# Altium project SoBrain.PrjPCB
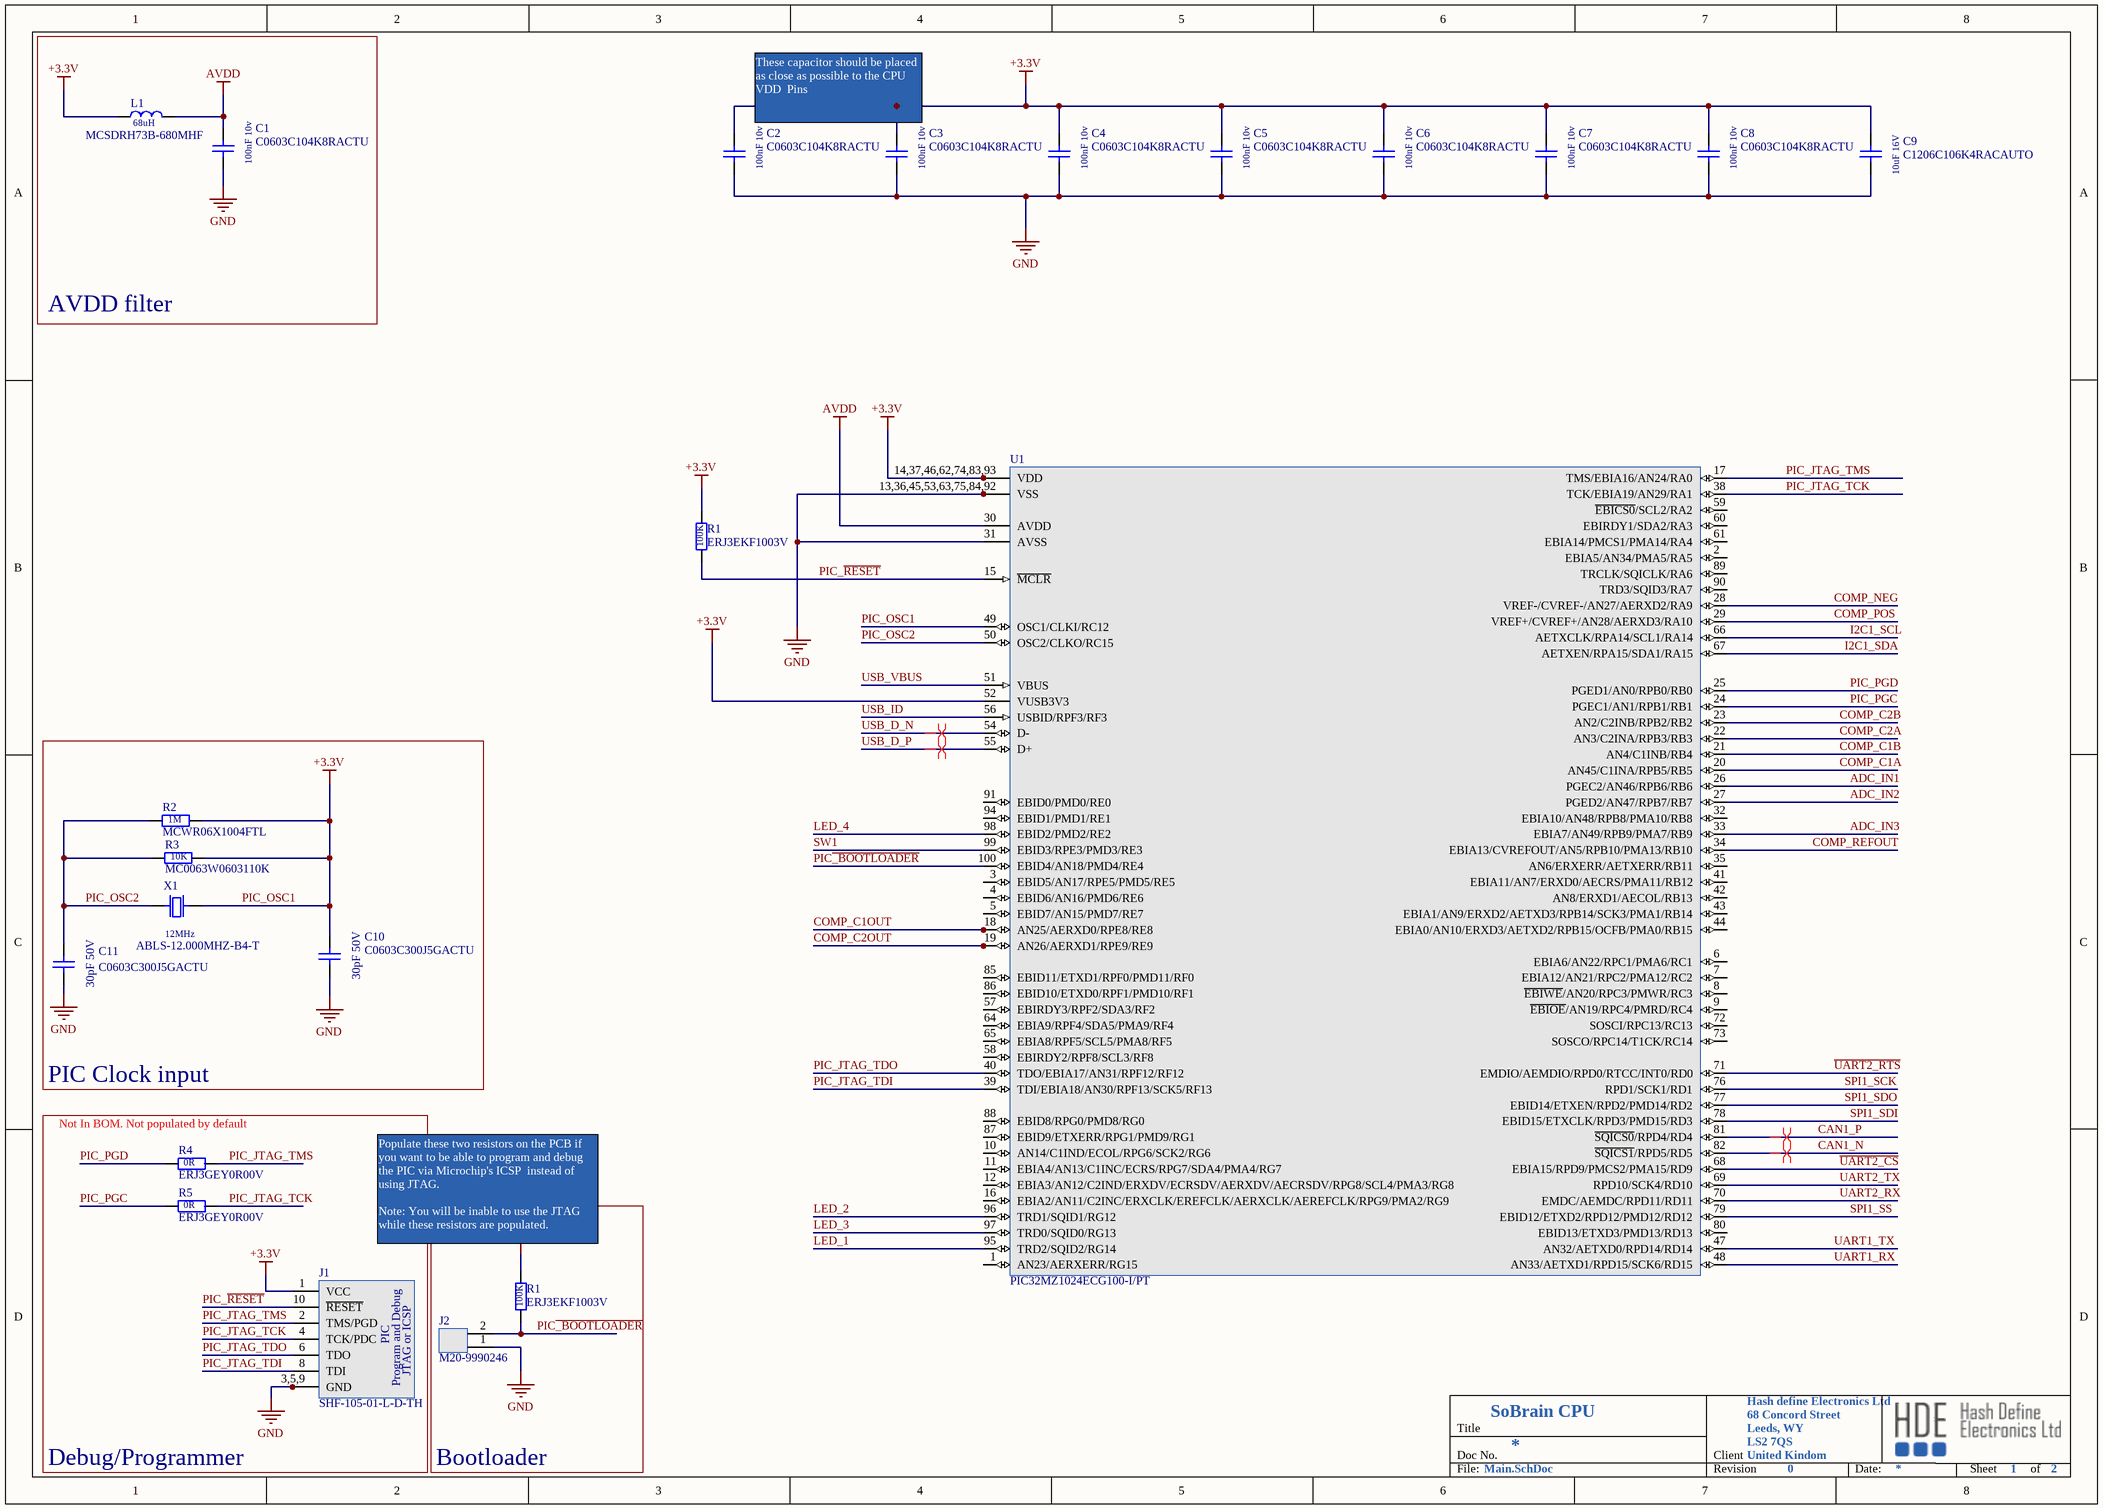
[diagram p0: Main.SchDoc]
2 sheets, 42 parts. Net scope: global (net labels, ports and power ports of the same name join across sheets).
Board file: SoBrain_PCB.PcbDoc
Sheets:
  Main.SchDoc
  Power.SchDoc

## Sheet Main.SchDoc: SoBrain CPU
size A3; Organization: Hash define Electronics Ltd; Address1: 68 Concord Street; Address2: Leeds, WY; Address3: LS2 7QS; Address4: United Kindom; Revision: 0; SheetNumber: 1; SheetTotal: 2

### Parts
(Parts that share a designator on the sheet are numbered #1, #2 ... from top to bottom, then left to right.)
C1  #NAME?  [CAP_0603]  (value not drawn)
C2  #NAME?  [CAP_0603]  (value not drawn)
C3  #NAME?  [CAP_0603]  (value not drawn)
C4  #NAME?  [CAP_0603]  (value not drawn)
C5  #NAME?  [CAP_0603]  (value not drawn)
C6  #NAME?  [CAP_0603]  (value not drawn)
C7  #NAME?  [CAP_0603]  (value not drawn)
C8  #NAME?  [CAP_0603]  (value not drawn)
C9  #NAME?  [CAP_1206]  (value not drawn)
C10  #NAME?  [CAP_0603]  (value not drawn)
C11  #NAME?  [CAP_0603]  (value not drawn)
J1  #NAME?  [SHF-105-01-L-D-TH]  (value not drawn)
J2  M20-9990246  [M20-9990246]
L1  MCSDRH73B-680MHF  [MCSDRH73B]
R1#1  #NAME?  [RES_0603]  (value not drawn)
R1#2  #NAME?  [RES_0603]  (value not drawn)
R2  MCWR06X1004FTL  [RES_0603]
R3  MC0063W0603110K  [RES_0603]
R4  ERJ3GEY0R00V  [RES_0603]  (no BOM)
R5  ERJ3GEY0R00V  [RES_0603]  (no BOM)
U1  PIC32MZ1024ECG100-I/PT  [TQFP100_0.5mm]
X1  ABLS-12.000MHZ-B4-T  [9C_Crystal]

### Blocks framed on the sheet
AVDD filter: C1 L1
PIC Clock input: C10 C11 R2 R3 X1
Debug/Programmer: J1 R4 R5
Bootloader: J2 R1#2

### Nets
AVDD: C1.2 L1.2 U1.30(AVDD)
GND: C1.1 C2.1 C3.1 C4.1 C5.1 C6.1 C7.1 C8.1 C9.1 C10.1 C11.1 J1.3,5,9(GND) J1.5(GND) J1.9(GND) J2.1 U1.13,36,45,53,63,75,84,92(VSS) U1.31(AVSS) U1.36(VSS) U1.45(VSS) U1.53(VSS) U1.63(VSS) U1.75(VSS) U1.84(VSS) U1.92(VSS)
PIC_OSC1: C2.2 C3.2 C4.2 C5.2 C6.2 C7.2 C8.2 C9.2 C10.2 J1.1(VCC) L1.1 R1#1.2 R1#2.2 R2.2 R3.2 U1.14,37,46,62,74,83,93(VDD) U1.37(VDD) U1.46(VDD) U1.49(OSC1/CLKI/RC12) U1.52(VUSB3V3) U1.62(VDD) U1.74(VDD) U1.83(VDD) U1.93(VDD) X1.2  [also labelled +3.3V]
ADC_IN1: U1.26(PGEC2/AN46/RPB6/RB6)
ADC_IN2: U1.27(PGED2/AN47/RPB7/RB7)
ADC_IN3: U1.33(EBIA7/AN49/RPB9/PMA7/RB9)
CAN1_N: U1.82(~{SQICS1}/RPD5/RD5)
CAN1_P: U1.81(~{SQICS0}/RPD4/RD4)
COMP_C1A: U1.20(AN45/C1INA/RPB5/RB5)
COMP_C1B: U1.21(AN4/C1INB/RB4)
COMP_C1OUT: U1.18(AN25/AERXD0/RPE8/RE8)
COMP_C2A: U1.22(AN3/C2INA/RPB3/RB3)
COMP_C2B: U1.23(AN2/C2INB/RPB2/RB2)
COMP_C2OUT: U1.19(AN26/AERXD1/RPE9/RE9)
COMP_NEG: U1.28(VREF-/CVREF-/AN27/AERXD2/RA9)
COMP_POS: U1.29(VREF+/CVREF+/AN28/AERXD3/RA10)
COMP_REFOUT: U1.34(EBIA13/CVREFOUT/AN5/RPB10/PMA13/RB10)
I2C1_SCL: U1.66(AETXCLK/RPA14/SCL1/RA14)
I2C1_SDA: U1.67(AETXEN/RPA15/SDA1/RA15)
LED_1: U1.95(TRD2/SQID2/RG14)
LED_2: U1.96(TRD1/SQID1/RG12)
LED_3: U1.97(TRD0/SQID0/RG13)
LED_4: U1.98(EBID2/PMD2/RE2)
PIC~{_BOOTLOADER}: J2.2 R1#2.1 U1.100(EBID4/AN18/PMD4/RE4)
PIC_JTAG_TCK: J1.4(TCK/PDC) R5.2 U1.38(TCK/EBIA19/AN29/RA1)
PIC_JTAG_TDI: J1.8(TDI) U1.39(TDI/EBIA18/AN30/RPF13/SCK5/RF13)
PIC_JTAG_TDO: J1.6(TDO) U1.40(TDO/EBIA17/AN31/RPF12/RF12)
PIC_JTAG_TMS: J1.2(TMS/PGD) R4.2 U1.17(TMS/EBIA16/AN24/RA0)
PIC_OSC2: C11.2 R2.1 R3.1 U1.50(OSC2/CLKO/RC15) X1.1
PIC_PGC: R5.1 U1.24(PGEC1/AN1/RPB1/RB1)
PIC_PGD: R4.1 U1.25(PGED1/AN0/RPB0/RB0)
PIC_~{RESET}: J1.10(~{RESET}) R1#1.1 U1.15(~{MCLR})
SPI1_SCK: U1.76(RPD1/SCK1/RD1)
SPI1_SDI: U1.78(EBID15/ETXCLK/RPD3/PMD15/RD3)
SPI1_SDO: U1.77(EBID14/ETXEN/RPD2/PMD14/RD2)
SPI1_SS: U1.79(EBID12/ETXD2/RPD12/PMD12/RD12)
SW1: U1.99(EBID3/RPE3/PMD3/RE3)
~{UART2_CS}: U1.68(EBIA15/RPD9/PMCS2/PMA15/RD9)
~{UART2_RTS}: U1.71(EMDIO/AEMDIO/RPD0/RTCC/INT0/RD0)
UART1_RX: U1.48(AN33/AETXD1/RPD15/SCK6/RD15)
UART1_TX: U1.47(AN32/AETXD0/RPD14/RD14)
UART2_RX: U1.70(EMDC/AEMDC/RPD11/RD11)
UART2_TX: U1.69(RPD10/SCK4/RD10)
USB_D_N: U1.54(D-)
USB_D_P: U1.55(D+)
USB_ID: U1.56(USBID/RPF3/RF3)
USB_VBUS: U1.51(VBUS)

Not connected (* = marked no-connect by the designer): J1 7(NC); U1 1(AN23/AERXERR/RG15) 2(EBIA5/AN34/PMA5/RA5) 3(EBID5/AN17/RPE5/PMD5/RE5) 4(EBID6/AN16/PMD6/RE6) 5(EBID7/AN15/PMD7/RE7) 6(EBIA6/AN22/RPC1/PMA6/RC1) 7(EBIA12/AN21/RPC2/PMA12/RC2) 8(~{EBIWE}/AN20/RPC3/PMWR/RC3) 9(~{EBIOE}/AN19/RPC4/PMRD/RC4) 10(AN14/C1IND/ECOL/RPG6/SCK2/RG6) 11(EBIA4/AN13/C1INC/ECRS/RPG7/SDA4/PMA4/RG7) 12(EBIA3/AN12/C2IND/ERXDV/ECRSDV/AERXDV/AECRSDV/RPG8/SCL4/PMA3/RG8) 16(EBIA2/AN11/C2INC/ERXCLK/EREFCLK/AERXCLK/AEREFCLK/RPG9/PMA2/RG9) 32(EBIA10/AN48/RPB8/PMA10/RB8) 35(AN6/ERXERR/AETXERR/RB11) 41(EBIA11/AN7/ERXD0/AECRS/PMA11/RB12) 42(AN8/ERXD1/AECOL/RB13) 43(EBIA1/AN9/ERXD2/AETXD3/RPB14/SCK3/PMA1/RB14) 44(EBIA0/AN10/ERXD3/AETXD2/RPB15/OCFB/PMA0/RB15) 57(EBIRDY3/RPF2/SDA3/RF2) 58(EBIRDY2/RPF8/SCL3/RF8) 59(~{EBICS0}/SCL2/RA2) 60(EBIRDY1/SDA2/RA3) 61(EBIA14/PMCS1/PMA14/RA4) 64(EBIA9/RPF4/SDA5/PMA9/RF4) 65(EBIA8/RPF5/SCL5/PMA8/RF5) 72(SOSCI/RPC13/RC13) 73(SOSCO/RPC14/T1CK/RC14) 80(EBID13/ETXD3/PMD13/RD13) 85(EBID11/ETXD1/RPF0/PMD11/RF0) 86(EBID10/ETXD0/RPF1/PMD10/RF1) 87(EBID9/ETXERR/RPG1/PMD9/RG1) 88(EBID8/RPG0/PMD8/RG0) 89(TRCLK/SQICLK/RA6) 90(TRD3/SQID3/RA7) 91(EBID0/PMD0/RE0) 94(EBID1/PMD1/RE1)

### Layout directives
differential pair: CAN1_N, CAN1_P, USB_D_N, USB_D_P

### Notes on the sheet
- These capacitor should be placed as close as possible to the CPU VDD  Pins
- (near C1) Keep inductor and capacitor Traces Short and Close to the CPU.
  TAD = ADC convertion rate = 62.5ns
  F = adc convertiong rate = (1/TAD)/2 = 8Mhz
  C = AVdd coupling capacitor = 100nF
  L = (1/2*pi*F*sqr(C))^2 = 62.9uH 68uH
  - Inductor must have impedace resistor < 1ohm
  - Inductor must handle more than 10mA
- (near C10) Keep Crystal Traces Short and Close to the CPU.
  CStray 3pF
  CL = (Cx/2)+CStray
- (near R4) Not In BOM. Not populated by default
- (near R1#2) Populate these two resistors on the PCB if you want to be able to program and debug the PIC via Microchip's ICSP  instead of using JTAG.
  Note: You will be inable to use the JTAG while these resistors are populated.
- (near R1#2) Enable the USB Bootloader on reset.
  LOW = Enable usb bootloader
  High  = Run user code
- Title
- Doc No.
- Client
- File:
- Revision
- Date:
- Sheet
- of
- (in symbol ABLS-12.000MHZ-B4-T) 12MHz
- (in symbol C0603C104K8RACTU) 100nF 10v
- (in symbol C0603C300J5GACTU) 30pF 50V
- (in symbol C1206C106K4RACAUTO) 10uF 16V
- (in symbol DEBUG_PIC_JTAG_ICSP) PIC; JTAG or ICSP; Program and Debug
- (in symbol ERJ3EKF1003V) 100K
- (in symbol ERJ3GEY0R00V) 0R
- (in symbol MC0063W0603110K) 10K
- (in symbol MCSDRH73B-680MHF) 68uH
- (in symbol MCWR06X1004FTL) 1M

### Library data of the parts
C1-C8 = C0603C104K8RACTU: 100nF, 10V, 0603, -55C to 125C, X7R, 10%; Manufacture: KEMET; Type: Capacitor; Surface_Mount: true; Farnell Code: 2112833; PartNum: C0603C104K8RACTU
C9 = C1206C106K4RACAUTO: 10uF, 16V,  1206, -55C to 125C, X7R, 10%, Automotive; Manufacture: KEMET; Type: Capacitor; Surface_Mount: true; Farnell Code: 2070502; PartNum: C1206C106K4RACAUTO
C10 C11 = C0603C300J5GACTU: 30pF, 50V, 0603, -55C to 125C, COG/NP0, 5%; Manufacture: KEMET; Type: Capacitor; Surface_Mount: true; Farnell Code: 1865477; PartNum: C0603C300J5GACTU
J1 = DEBUG_PIC_JTAG_ICSP: ARM 10-Pin Serial Wire Connector (1.27mm); Manufacture: SAMTEC; Surface_Mount: false; Farnell Code: 2308450; Type: Connector; PartNum: SHF-105-01-L-D-TH
J2 = M20-9990246: 2.54 Pitch, Pin Header; Manufacture: HARWIN; Surface_Mount: false; Farnell Code: 1022247; Type: Connector; PartNum: M20-9990246
L1 = MCSDRH73B-680MHF: 68UH, 20%, 1.04A, 0.397ohm. inductor; Manufacture: MULTICOMP; Surface_Mount: true; Farnell Code: 1864481; Type: Inductor; PartNum: MCSDRH73B-680MHF
R1#1 R1#2 = ERJ3EKF1003V: 100K, 0603, 1%, 0.1W, Resistor; Manufacture: PANASONIC ELECTRONIC COMPONENTS; Surface_Mount: true; Farnell Code: 2303232; Type: Resistor; PartNum: ERJ3EKF1003V
R2 = MCWR06X1004FTL: 1M, 0603, 1%, 62.5mW, resistor; Manufacture: MULTICOMP; Surface_Mount: true; Farnell Code: 2447285; Type: Resistor; PartNum: MCWR06X1004FTL
R3 = MC0063W0603110K: 10K, 0603, 1%, 0.063W, resistor; Manufacture: MULTICOMP; Surface_Mount: true; Farnell Code: 9330399; Type: Resistor; PartNum: MC0063W0603110K
R4 R5 = ERJ3GEY0R00V: 0R, 0603, 0.1W, 75V, resistor; Manufacture: PANASONIC ELECTRONIC COMPONENTS; Surface_Mount: true; Farnell Code: 2059527; Type: Resistor; PartNum: ERJ3GEY0R00V
U1 = PIC32MZ1024ECG100-I/PT: PIC32, 1MB, 512KB, 200MHZ, TQFP-44; Manufacture: Microchip; Surface_Mount: true; Type: Integrated Circuit; Farnell Code: 2387251; PartNum: PIC32MZ1024ECG100-I/PT
X1 = ABLS-12.000MHZ-B4-T: CRYSTAL, 12MHZ, 18PF; Manufacture: ABRACON; Surface_Mount: true; Type: Crystal; Farnell Code: 2467716; PartNum: ABLS-12.000MHZ-B4-T

## Sheet Power.SchDoc: Power and Connectors
size A3; Organization: Hash define Electronics Ltd; Address1: 68 Concord Street; Address2: Leeds, WY; Address3: LS2 7QS; Address4: United Kindom; Revision: 0; SheetNumber: 2; SheetTotal: 2
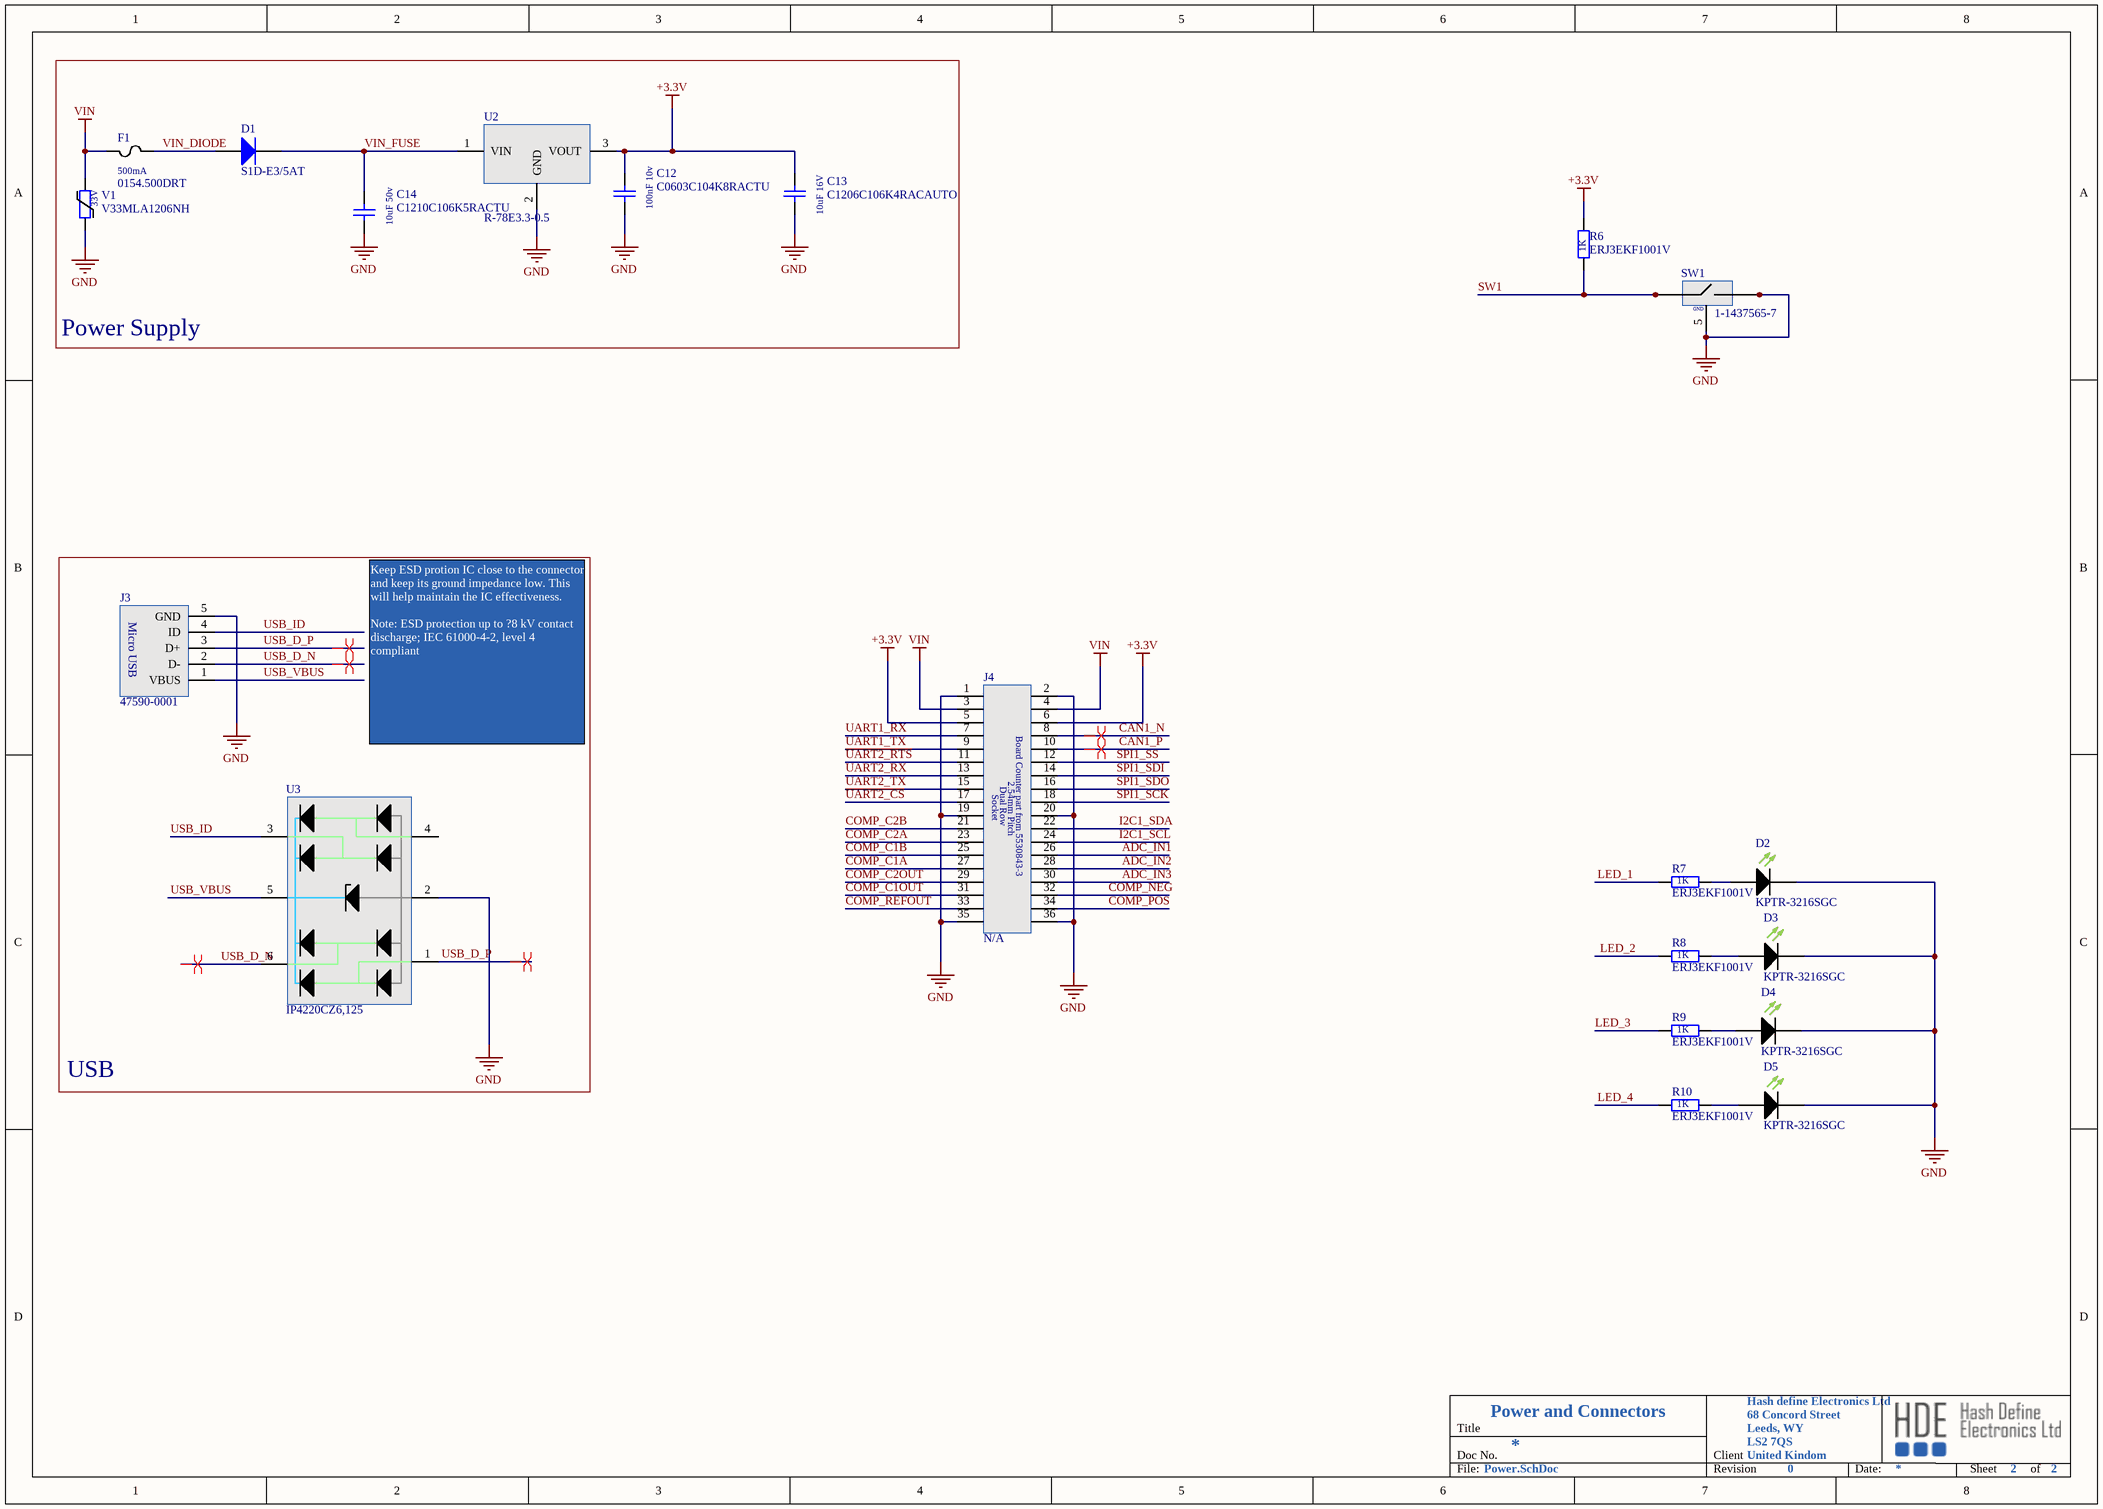
[diagram p1: Power.SchDoc]

### Parts
C12  #NAME?  [CAP_0603]  (value not drawn)
C13  #NAME?  [CAP_1206]  (value not drawn)
C14  #NAME?  [CAP_1210]  (value not drawn)
D1  #NAME?  [DO-214AC]  (value not drawn)
D2  LED  [LED_1206]  (value not drawn)
D3  LED  [LED_1206]  (value not drawn)
D4  LED  [LED_1206]  (value not drawn)
D5  LED  [LED_1206]  (value not drawn)
F1  #NAME?  [SMF_OMNI-BLOK]  (value not drawn)
J3  47590-0001  [47590-0001]
J4  N/A  [5530843-3_BoardEdge]
R6  #NAME?  [RES_0603]  (value not drawn)
R7  #NAME?  [RES_0603]  (value not drawn)
R8  #NAME?  [RES_0603]  (value not drawn)
R9  #NAME?  [RES_0603]  (value not drawn)
R10  #NAME?  [RES_0603]  (value not drawn)
SW1  1-1437565-7  [1-1437565-7]
U2  #NAME?  [R-78E3.3-0.5]  (value not drawn)
U3  IP4220CZ6,125  [TSOP6]
V1  #NAME?  [1206_LittelFuse_Varistor]  (value not drawn)

### Blocks framed on the sheet
Power Supply: C12-C14 D1 F1 U2 V1
USB: J3 U3

### Nets
+3.3V: C12.2 C13.2 J4.5 J4.6 R6.2 U2.3(VOUT)  [project net PIC_OSC1]
GND: C12.1 C13.1 C14.1 D2.1(K) D3.1(K) D4.1(K) D5.1(K) J3.5(GND) J4.1 J4.2 J4.19 J4.20 J4.35 J4.36 SW1.3 SW1.4 SW1.5(GND) U2.2(GND) U3.2(GND) V1.1
VIN: F1.1 J4.3 J4.4 V1.2
ADC_IN1: J4.26
ADC_IN2: J4.28
ADC_IN3: J4.30
CAN1_N: J4.8
CAN1_P: J4.10
COMP_C1A: J4.27
COMP_C1B: J4.25
COMP_C1OUT: J4.31
COMP_C2A: J4.23
COMP_C2B: J4.21
COMP_C2OUT: J4.29
COMP_NEG: J4.32
COMP_POS: J4.34
COMP_REFOUT: J4.33
I2C1_SCL: J4.24
I2C1_SDA: J4.22
LED_1: R7.1
LED_2: R8.1
LED_3: R9.1
LED_4: R10.1
SPI1_SCK: J4.18
SPI1_SDI: J4.14
SPI1_SDO: J4.16
SPI1_SS: J4.12
SW1: R6.1 SW1.1 SW1.2
~{UART2_CS}: J4.17
~{UART2_RTS}: J4.11
UART1_RX: J4.7
UART1_TX: J4.9
UART2_RX: J4.13
UART2_TX: J4.15
USB_D_N: J3.2(D-) U3.6(IO4)
USB_D_P: J3.3(D+) U3.1(IO1)
USB_ID: J3.4(ID) U3.3(IO2)
USB_VBUS: J3.1(VBUS) U3.5(Vp)
VIN_DIODE: D1.2(A) F1.2
VIN_FUSE: C14.2 D1.1(K) U2.1(VIN)
NetD2_2: D2.2(A) R7.2
NetD3_2: D3.2(A) R8.2
NetD4_2: D4.2(A) R9.2
NetD5_2: D5.2(A) R10.2

Not connected (* = marked no-connect by the designer): U3 4(IO3)

### Layout directives
differential pair: CAN1_N, CAN1_P, USB_D_N, USB_D_P

### Notes on the sheet
- VIN Range: 7.1V - 28V
- Keep ESD protion IC close to the connector and keep its ground impedance low. This will help maintain the IC effectiveness.
  Note: ESD protection up to ?8 kV contact discharge; IEC 61000-4-2, level 4 compliant
- Title
- Doc No.
- Client
- File:
- Revision
- Date:
- Sheet
- of
- (in symbol 0154.500DRT) 500mA
- (in symbol 47590-0001) Micro USB
- (in symbol 5530843-3_BoardEdge) Board Counter part from 5530843-3; 2.54mm Pitch; Dual Row; Socket
- (in symbol C0603C104K8RACTU) 100nF 10v
- (in symbol C1206C106K4RACAUTO) 10uF 16V
- (in symbol C1210C106K5RACTU) 10uF 50v
- (in symbol ERJ3EKF1001V) 1K
- (in symbol V33MLA1206NH) 33V

### Library data of the parts
C12 = C0603C104K8RACTU: as C1 on sheet Main; Farnell Code: 2112833; PartNum: C0603C104K8RACTU
C13 = C1206C106K4RACAUTO: as C9 on sheet Main; Farnell Code: 2070502; PartNum: C1206C106K4RACAUTO
C14 = C1210C106K5RACTU: MLCC, X7R, 10uF, 50V, 1210; Manufacture: KEMET; Type: Capacitor; Surface_Mount: true; Farnell Code: 2449143; PartNum: C1210C106K5RACTU
D1 = S1D-E3/5AT: 1A, 200V, SMD Diode; Manufacture: VISHAY SEMICONDUCTOR; Type: Varistor; Surface_Mount: true; Farnell Code: 9550232; PartNum: S1D-E3/5AT
D2-D5 = KPTR-3216SGC: Green, 1206, SMD LED; Manufacture: KINGBRIGHT; Surface_Mount: true; Farnell Code: 2099255; Type: LED; PartNum: KPTR-3216SGC
F1 = 0154.500DRT: 500mA, SMD, 125v, -55C to 125C; Manufacture: LITTELFUSE; Type: Fuse; Surface_Mount: true; Farnell Code: 9943684; PartNum: 0154.500DRT
J3 = 47590-0001: Micro USB, Top Mount; Manufacture: Molex; Surface_Mount: true; Type: Connector; Farnell Code: 1568022; PartNum: 47590-0001
J4 = 5530843-3_BoardEdge: 36way dual row 2.54mm socket. Board edge counter partconnector; Surface_Mount: true; Farnell Code: N/A; Manufacture: N/A; Type: Connector; PartNum: N/A
R6-R10 = ERJ3EKF1001V: 1K, 0603, 1%, 0.1W, resistor; Manufacture: PANASONIC ELECTRONIC COMPONENTS; Surface_Mount: true; Farnell Code: 2303145; Type: Resistor; PartNum: ERJ3EKF1001V
SW1 = 1-1437565-7: TACTILE SWITCH, SPST, 0.05A, 24V; Manufacture: TE CONNECTIVITY / ALCOSWITCH; Surface_Mount: true; Farnell Code: 2468759; Type: Connector; PartNum: 1-1437565-7
U2 = R-78E3.3-0.5: 3.3V, 500mA, DC-DC; Manufacture: RECOM POWER; Surface_Mount: false; Type: Regulator; Farnell Code: 2218602; PartNum: R-78E3.3-0.5
U3 = IP4220CZ6,125: ESD PROTECTION, DUAL USB 2.0, 6TSOP; Manufacture: NXP; Surface_Mount: true; Farnell Code: 1506629; Type: ESD Protection; PartNum: IP4220CZ6,125
V1 = V33MLA1206NH: 33V, 1206, 180Apk, Clamp 75V; Manufacture: LITTELFUSE; Surface_Mount: true; Farnell Code: 1816942; Type: Varistor; PartNum: V33MLA1206NH

## Nets that join several sheets
GND: Main (24 pins), Power (20 pins)
PIC_OSC1: Main (25 pins), Power (6 pins)
ADC_IN1: Main (U1.26), Power (J4.26)
ADC_IN2: Main (U1.27), Power (J4.28)
ADC_IN3: Main (U1.33), Power (J4.30)
CAN1_N: Main (U1.82), Power (J4.8)
CAN1_P: Main (U1.81), Power (J4.10)
COMP_C1A: Main (U1.20), Power (J4.27)
COMP_C1B: Main (U1.21), Power (J4.25)
COMP_C1OUT: Main (U1.18), Power (J4.31)
COMP_C2A: Main (U1.22), Power (J4.23)
COMP_C2B: Main (U1.23), Power (J4.21)
COMP_C2OUT: Main (U1.19), Power (J4.29)
COMP_NEG: Main (U1.28), Power (J4.32)
COMP_POS: Main (U1.29), Power (J4.34)
COMP_REFOUT: Main (U1.34), Power (J4.33)
I2C1_SCL: Main (U1.66), Power (J4.24)
I2C1_SDA: Main (U1.67), Power (J4.22)
LED_1: Main (U1.95), Power (R7.1)
LED_2: Main (U1.96), Power (R8.1)
LED_3: Main (U1.97), Power (R9.1)
LED_4: Main (U1.98), Power (R10.1)
SPI1_SCK: Main (U1.76), Power (J4.18)
SPI1_SDI: Main (U1.78), Power (J4.14)
SPI1_SDO: Main (U1.77), Power (J4.16)
SPI1_SS: Main (U1.79), Power (J4.12)
SW1: Main (U1.99), Power (R6.1 SW1.1 SW1.2)
~{UART2_CS}: Main (U1.68), Power (J4.17)
~{UART2_RTS}: Main (U1.71), Power (J4.11)
UART1_RX: Main (U1.48), Power (J4.7)
UART1_TX: Main (U1.47), Power (J4.9)
UART2_RX: Main (U1.70), Power (J4.13)
UART2_TX: Main (U1.69), Power (J4.15)
USB_D_N: Main (U1.54), Power (J3.2 U3.6)
USB_D_P: Main (U1.55), Power (J3.3 U3.1)
USB_ID: Main (U1.56), Power (J3.4 U3.3)
USB_VBUS: Main (U1.51), Power (J3.1 U3.5)